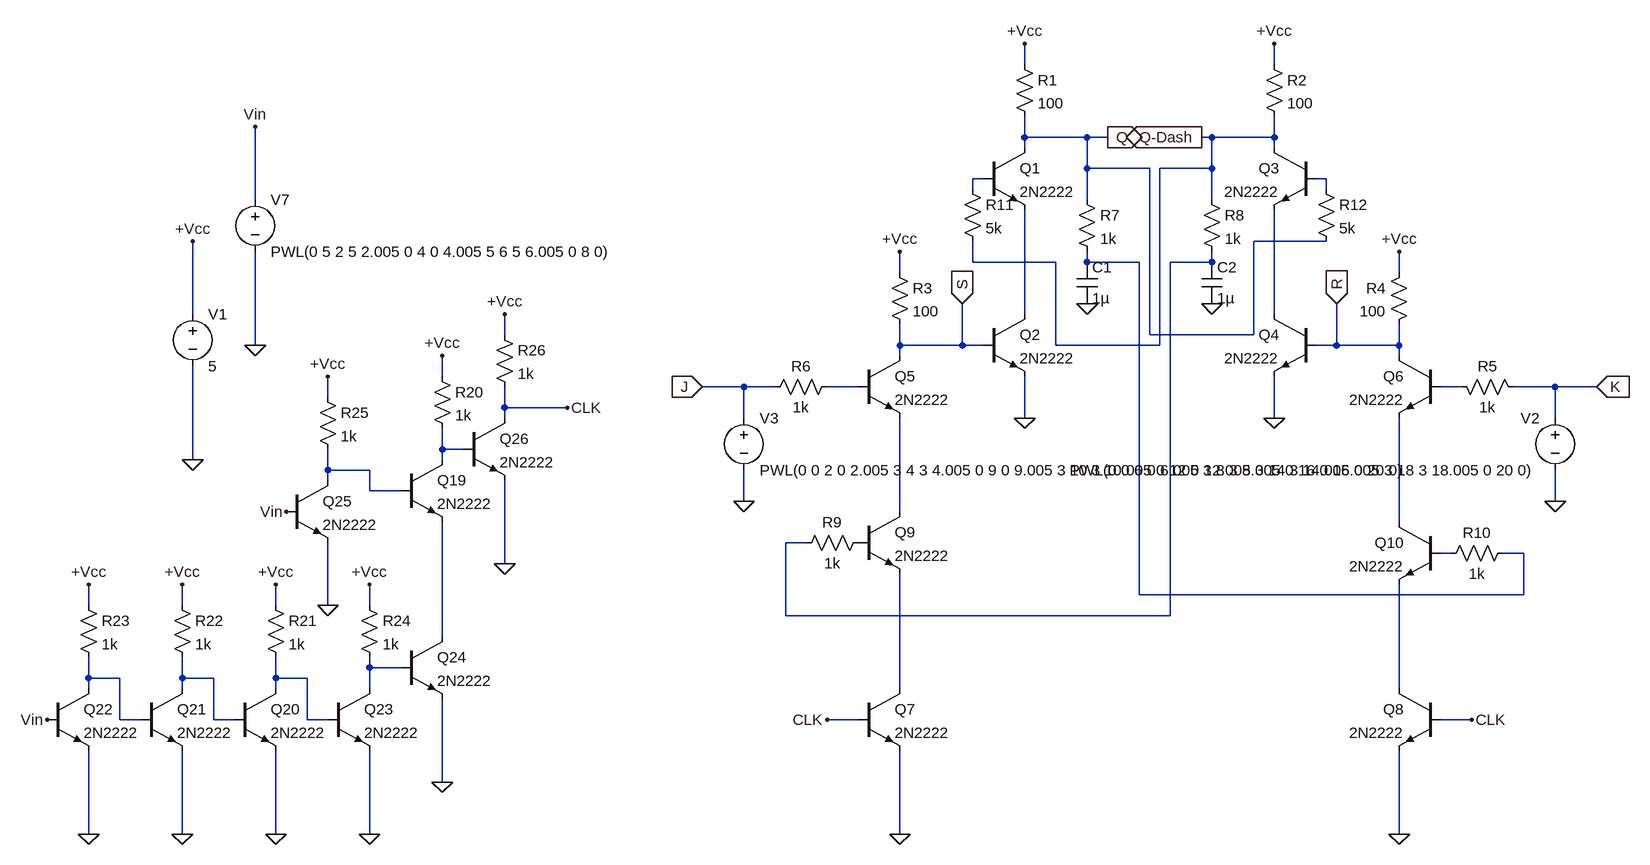
[diagram p0: schematic JK with falling edge detector.asc]
JK with falling edge detector.asc, the LTspice schematic file:
Version 4
SHEET 1 2648 1936
WIRE 208 -256 208 -288
WIRE 592 -256 592 -288
WIRE 208 -144 208 -176
WIRE 304 -144 208 -144
WIRE 336 -144 304 -144
WIRE 496 -144 480 -144
WIRE 592 -144 592 -176
WIRE 592 -144 496 -144
WIRE 208 -128 208 -144
WIRE 592 -128 592 -144
WIRE 304 -96 304 -144
WIRE 400 -96 304 -96
WIRE 496 -96 496 -144
WIRE 496 -96 416 -96
WIRE 144 -80 128 -80
WIRE 672 -80 656 -80
WIRE 128 -64 128 -80
WIRE 672 -64 672 -80
WIRE -976 -48 -976 -160
WIRE 304 -48 304 -96
WIRE 496 -48 496 -96
WIRE 672 16 560 16
WIRE 128 48 128 16
WIRE 256 48 128 48
WIRE 304 48 304 32
WIRE 384 48 304 48
WIRE 496 48 496 32
WIRE 496 48 432 48
WIRE 16 64 16 32
WIRE 304 64 304 48
WIRE 496 64 496 48
WIRE 784 64 784 32
WIRE -1072 128 -1072 16
WIRE 208 128 208 -32
WIRE 592 128 592 -32
WIRE -592 160 -592 128
WIRE 400 160 400 -96
WIRE 560 160 560 16
WIRE 560 160 400 160
WIRE -976 176 -976 32
WIRE 16 176 16 144
WIRE 112 176 112 112
WIRE 112 176 16 176
WIRE 144 176 112 176
WIRE 256 176 256 48
WIRE 416 176 416 -96
WIRE 416 176 256 176
WIRE 688 176 688 112
WIRE 688 176 656 176
WIRE 784 176 784 144
WIRE 784 176 688 176
WIRE 16 192 16 176
WIRE 784 192 784 176
WIRE -688 224 -688 192
WIRE -224 240 -288 240
WIRE -176 240 -224 240
WIRE -48 240 -96 240
WIRE 880 240 848 240
WIRE 1024 240 960 240
WIRE 1088 240 1024 240
WIRE -864 256 -864 224
WIRE -592 272 -592 240
WIRE -496 272 -592 272
WIRE -592 288 -592 272
WIRE -224 288 -224 240
WIRE 208 288 208 224
WIRE 592 288 592 224
WIRE 1024 288 1024 240
WIRE -688 336 -688 304
WIRE -656 336 -688 336
WIRE -1072 352 -1072 208
WIRE -688 352 -688 336
WIRE -864 368 -864 336
WIRE -800 368 -864 368
WIRE -864 384 -864 368
WIRE -800 400 -800 368
WIRE -752 400 -800 400
WIRE -224 416 -224 368
WIRE 1024 416 1024 368
WIRE 16 432 16 288
WIRE 784 448 784 288
WIRE -128 480 -160 480
WIRE 864 496 848 496
WIRE 976 496 944 496
WIRE -592 512 -592 384
WIRE 384 560 384 48
WIRE 976 560 976 496
WIRE 976 560 384 560
WIRE -1232 576 -1232 544
WIRE -1088 576 -1088 544
WIRE -944 576 -944 544
WIRE -864 576 -864 480
WIRE -800 576 -800 544
WIRE -160 592 -160 480
WIRE 432 592 432 48
WIRE 432 592 -160 592
WIRE -688 624 -688 448
WIRE -800 672 -800 656
WIRE -752 672 -800 672
WIRE -1232 688 -1232 656
WIRE -1184 688 -1232 688
WIRE -1088 688 -1088 656
WIRE -1040 688 -1088 688
WIRE -944 688 -944 656
WIRE -896 688 -944 688
WIRE -1232 704 -1232 688
WIRE -1088 704 -1088 688
WIRE -944 704 -944 688
WIRE -800 704 -800 672
WIRE 16 704 16 528
WIRE 784 704 784 544
WIRE -1184 752 -1184 688
WIRE -1152 752 -1184 752
WIRE -1040 752 -1040 688
WIRE -1008 752 -1040 752
WIRE -896 752 -896 688
WIRE -864 752 -896 752
WIRE -48 752 -96 752
WIRE 896 752 848 752
WIRE -688 848 -688 720
WIRE -1232 928 -1232 800
WIRE -1088 928 -1088 800
WIRE -944 928 -944 800
WIRE -800 928 -800 800
WIRE 16 928 16 800
WIRE 784 928 784 800
FLAG 208 -288 +Vcc
FLAG 592 -288 +Vcc
FLAG 16 32 +Vcc
FLAG 784 32 +Vcc
FLAG 336 -144 Q
IOPIN 336 -144 Out
FLAG 480 -144 Q-Dash
IOPIN 480 -144 Out
FLAG 592 288 0
FLAG 208 288 0
FLAG 688 112 R
IOPIN 688 112 In
FLAG 112 112 S
IOPIN 112 112 In
FLAG 16 928 0
FLAG 784 928 0
FLAG 1024 416 0
FLAG 1088 240 K
IOPIN 1088 240 In
FLAG -224 416 0
FLAG -288 240 J
IOPIN -288 240 In
FLAG 304 112 0
FLAG 496 112 0
FLAG 896 752 CLK
FLAG -96 752 CLK
FLAG -688 192 +Vcc
FLAG -944 928 0
FLAG -944 544 +Vcc
FLAG -1088 928 0
FLAG -1088 544 +Vcc
FLAG -1232 928 0
FLAG -1232 544 +Vcc
FLAG -800 928 0
FLAG -800 544 +Vcc
FLAG -688 848 0
FLAG -1296 752 Vin
FLAG -864 224 +Vcc
FLAG -928 432 Vin
FLAG -864 576 0
FLAG -592 512 0
FLAG -592 128 +Vcc
FLAG -496 272 CLK
FLAG -1072 16 +Vcc
FLAG -1072 352 0
FLAG -976 -160 Vin
FLAG -976 176 0
SYMBOL npn 144 -128 R0
SYMATTR InstName Q1
SYMATTR Value 2N2222
SYMBOL npn 144 128 R0
SYMATTR InstName Q2
SYMATTR Value 2N2222
SYMBOL npn 656 -128 M0
SYMATTR InstName Q3
SYMATTR Value 2N2222
SYMBOL npn 656 128 M0
SYMATTR InstName Q4
SYMATTR Value 2N2222
SYMBOL Res 192 -272 R0
SYMATTR InstName R1
SYMATTR Value 100
SYMBOL Res 576 -272 R0
SYMATTR InstName R2
SYMATTR Value 100
SYMBOL npn -48 192 R0
SYMATTR InstName Q5
SYMATTR Value 2N2222
SYMBOL Res 0 48 R0
SYMATTR InstName R3
SYMATTR Value 100
SYMBOL npn 848 192 M0
SYMATTR InstName Q6
SYMATTR Value 2N2222
SYMBOL Res 800 48 M0
SYMATTR InstName R4
SYMATTR Value 100
SYMBOL npn -48 704 R0
SYMATTR InstName Q7
SYMATTR Value 2N2222
SYMBOL npn 848 704 M0
SYMATTR InstName Q8
SYMATTR Value 2N2222
SYMBOL npn -48 432 R0
SYMATTR InstName Q9
SYMATTR Value 2N2222
SYMBOL npn 848 448 M0
SYMATTR InstName Q10
SYMATTR Value 2N2222
SYMBOL voltage 1024 272 M0
SYMATTR InstName V2
SYMATTR Value PWL(0 0 6 0 6.005 3 8 3 8.005 0 16 0 16.005 3 18 3 18.005 0 20 0)
SYMBOL Res 976 256 M270
WINDOW 0 32 56 VTop 2
WINDOW 3 0 56 VBottom 2
SYMATTR InstName R5
SYMATTR Value 1k
SYMBOL Res -80 224 R90
WINDOW 0 0 56 VBottom 2
WINDOW 3 32 56 VTop 2
SYMATTR InstName R6
SYMATTR Value 1k
SYMBOL voltage -224 272 R0
SYMATTR InstName V3
SYMATTR Value PWL(0 0 2 0 2.005 3 4 3 4.005 0 9 0 9.005 3 10 3 10.005 0 12 0 12.005 3 14 3 14.005 0 20 0)
SYMBOL Res 288 -64 R0
SYMATTR InstName R7
SYMATTR Value 1k
SYMBOL Res 480 -64 R0
SYMATTR InstName R8
SYMATTR Value 1k
SYMBOL Res -32 464 R90
WINDOW 0 0 56 VBottom 2
WINDOW 3 32 56 VTop 2
SYMATTR InstName R9
SYMATTR Value 1k
SYMBOL Res 960 480 R90
WINDOW 0 0 56 VBottom 2
WINDOW 3 32 56 VTop 2
SYMATTR InstName R10
SYMATTR Value 1k
SYMBOL Res 112 -80 R0
SYMATTR InstName R11
SYMATTR Value 5k
SYMBOL Res 656 -80 R0
SYMATTR InstName R12
SYMATTR Value 5k
SYMBOL Cap 288 48 R0
SYMATTR InstName C1
SYMATTR Value 1µ
SYMBOL Cap 480 48 R0
SYMATTR InstName C2
SYMATTR Value 1µ
SYMBOL npn -752 352 R0
SYMATTR InstName Q19
SYMATTR Value 2N2222
SYMBOL Res -704 208 R0
SYMATTR InstName R20
SYMATTR Value 1k
SYMBOL npn -1008 704 R0
SYMATTR InstName Q20
SYMATTR Value 2N2222
SYMBOL Res -960 560 R0
SYMATTR InstName R21
SYMATTR Value 1k
SYMBOL npn -1152 704 R0
SYMATTR InstName Q21
SYMATTR Value 2N2222
SYMBOL Res -1104 560 R0
SYMATTR InstName R22
SYMATTR Value 1k
SYMBOL npn -1296 704 R0
SYMATTR InstName Q22
SYMATTR Value 2N2222
SYMBOL Res -1248 560 R0
SYMATTR InstName R23
SYMATTR Value 1k
SYMBOL npn -864 704 R0
SYMATTR InstName Q23
SYMATTR Value 2N2222
SYMBOL Res -816 560 R0
SYMATTR InstName R24
SYMATTR Value 1k
SYMBOL npn -752 624 R0
SYMATTR InstName Q24
SYMATTR Value 2N2222
SYMBOL npn -928 384 R0
SYMATTR InstName Q25
SYMATTR Value 2N2222
SYMBOL Res -880 240 R0
SYMATTR InstName R25
SYMATTR Value 1k
SYMBOL npn -656 288 R0
SYMATTR InstName Q26
SYMATTR Value 2N2222
SYMBOL Res -608 144 R0
SYMATTR InstName R26
SYMATTR Value 1k
SYMBOL voltage -1072 112 R0
SYMATTR InstName V1
SYMATTR Value 5
SYMBOL voltage -976 -64 R0
SYMATTR InstName V7
SYMATTR Value PWL(0 5 2 5 2.005 0 4 0 4.005 5 6 5 6.005 0 8 0)

The netlist it stands for:
* JK with falling edge detector.asc
Q1 Q N001 N005 0 2N2222
Q2 N005 S 0 0 2N2222
Q3 Q-Dash N002 N006 0 2N2222
Q4 N006 R 0 0 2N2222
R1 +Vcc Q 100
R2 +Vcc Q-Dash 100
Q5 S N007 N011 0 2N2222
R3 +Vcc S 100
Q6 R N008 N012 0 2N2222
R4 +Vcc R 100
Q7 N019 CLK 0 0 2N2222
Q8 N020 CLK 0 0 2N2222
Q9 N011 P001 N019 0 2N2222
Q10 N012 N013 N020 0 2N2222
V2 K 0 PWL(0 0 6 0 6.005 3 8 3 8.005 0 16 0 16.005 3 18 3 18.005 0 20 0)
R5 K N008 1k
R6 N007 J 1k
V3 J 0 PWL(0 0 2 0 2.005 3 4 3 4.005 0 9 0 9.005 3 10 3 10.005 0 12 0 12.005 3 14 3 14.005 0 20 0)
R7 Q N003 1k
R8 Q-Dash N004 1k
R9 P001 N004 1k
R10 N003 N013 1k
R11 N001 Q-Dash 5k
R12 N002 Q 5k
C1 N003 0 1µ
C2 N004 0 1µ
Q19 N009 N010 N014 0 2N2222
R20 +Vcc N009 1k
Q20 N018 N017 0 0 2N2222
R21 +Vcc N018 1k
Q21 N017 N016 0 0 2N2222
R22 +Vcc N017 1k
Q22 N016 Vin 0 0 2N2222
R23 +Vcc N016 1k
Q23 N015 N018 0 0 2N2222
R24 +Vcc N015 1k
Q24 N014 N015 0 0 2N2222
Q25 N010 Vin 0 0 2N2222
R25 +Vcc N010 1k
Q26 CLK N009 0 0 2N2222
R26 +Vcc CLK 1k
V1 +Vcc 0 5
V7 Vin 0 PWL(0 5 2 5 2.005 0 4 0 4.005 5 6 5 6.005 0 8 0)
.model NPN NPN
.model PNP PNP
.lib standard.bjt
.backanno
.end